# Altium schematic sheet CLOCK_SYNCHRON.SchDoc
size Tabloid; SheetNumber: 8; SheetTotal: 9
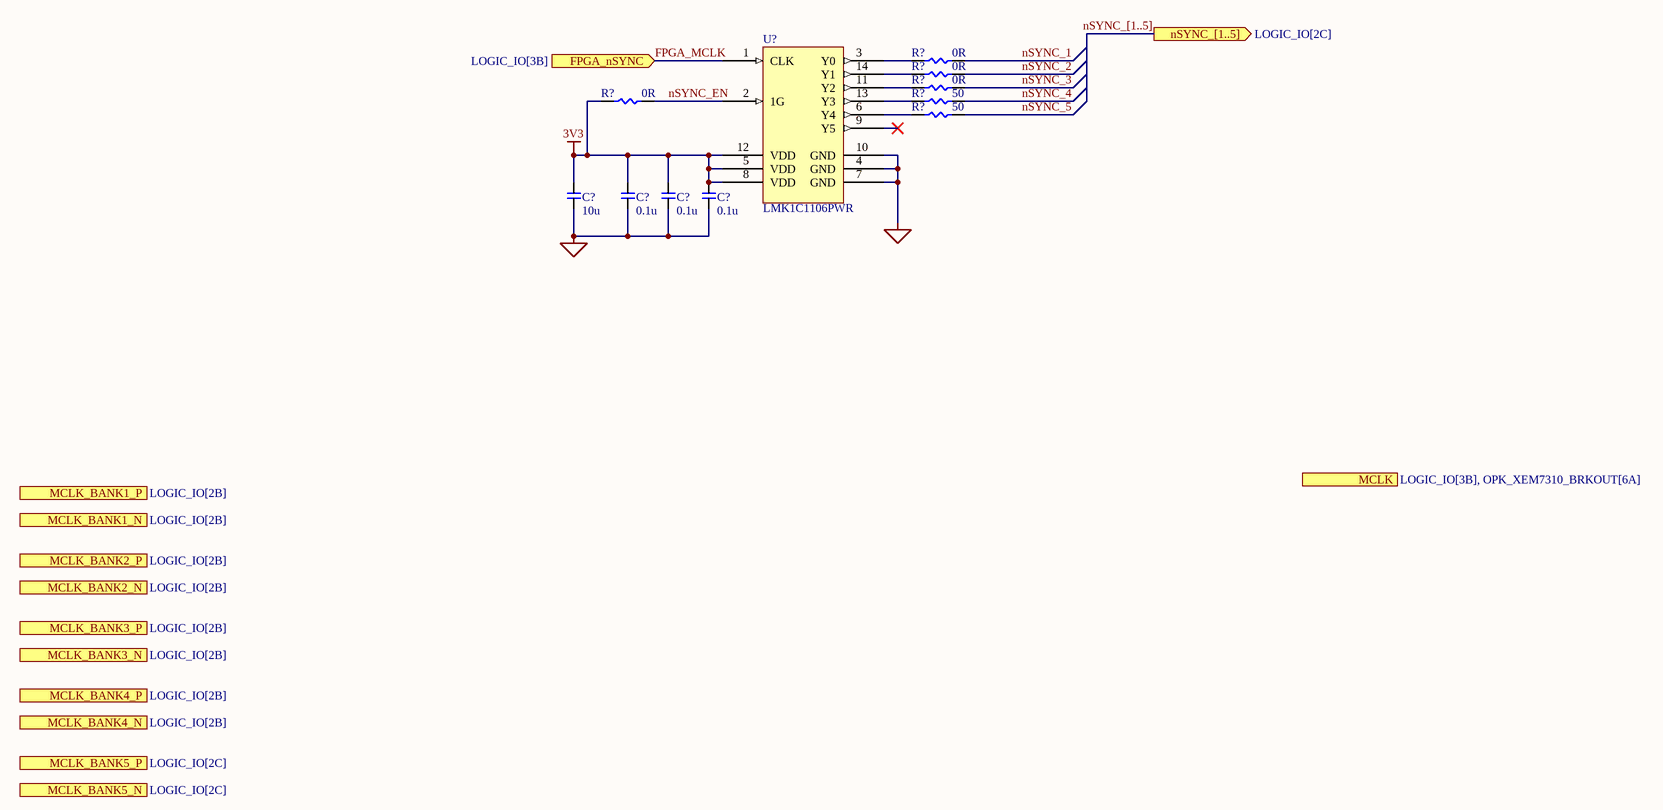
[diagram p0: CLOCK_SYNCHRON.SchDoc]

## Parts
(Parts that share a designator on the sheet are numbered #1, #2 ... from top to bottom, then left to right.)
C?#1  10u
C?#2  0.1u  [CAP_0402]
C?#3  0.1u  [CAP_0402]
C?#4  0.1u  [CAP_0402]
R?#1  0R  [RES_0402]
R?#2  0R  [RES_0402]
R?#3  0R  [RES_0402]
R?#4  0R  [RES_0402]
R?#5  50  [RES_0402]
R?#6  50  [RES_0402]
U?  LMK1C1106PWR  [TSOP65P640X120-14N]

## Ports
FPGA_nSYNC (in, see LOGIC_IO[3B]), MCLK (in, see LOGIC_IO[3B], OPK_XEM7310_BRKOUT[6A]), MCLK_BANK1_N (out, see LOGIC_IO[2B]), MCLK_BANK1_P (out, see LOGIC_IO[2B]), MCLK_BANK2_N (out, see LOGIC_IO[2B]), MCLK_BANK2_P (out, see LOGIC_IO[2B]), MCLK_BANK3_N (out, see LOGIC_IO[2B]), MCLK_BANK3_P (out, see LOGIC_IO[2B]), MCLK_BANK4_N (out, see LOGIC_IO[2B]), MCLK_BANK4_P (out, see LOGIC_IO[2B]), MCLK_BANK5_N (out, see LOGIC_IO[2C]), MCLK_BANK5_P (out, see LOGIC_IO[2C]), nSYNC_[1..5] (out, see LOGIC_IO[2C])

## Nets
3V3: C?#1.2 C?#2.2 C?#3.2 C?#4.2 R?#4.0 U?.5(VDD) U?.8(VDD) U?.12(VDD)
GND: C?#1.1 C?#2.1 C?#3.1 C?#4.1 U?.4(GND) U?.7(GND) U?.10(GND)
FPGA_MCLK: U?.1(CLK) ; port FPGA_nSYNC
nSYNC_1: R?#1.1
nSYNC_2: R?#2.1
nSYNC_3: R?#3.1
nSYNC_4: R?#5.1
nSYNC_5: R?#6.1
nSYNC_EN: R?#4.1 U?.2(1G)
NetR?#1_0: R?#1.0 U?.3(Y0)
NetR?#2_0: R?#2.0 U?.14(Y1)
NetR?#3_0: R?#3.0 U?.11(Y2)
NetR?#5_0: R?#5.0 U?.13(Y3)
NetR?#6_0: R?#6.0 U?.6(Y4)

Not connected (* = marked no-connect by the designer): U? 9(Y5)*

## Buses and harness runs
bus nSYNC_[1..5] = port nSYNC_[1..5]

## Library data of the parts
C?#1 = 10u: CAP CER 10uF 6.3V X5R 0603
C?#2-C?#4 = 0.1u: CAP CER 0.1uF 6V X7R 0402 10%
R?#1-R?#6 = RES_0402: RES SMD 0402; Manufacturer: *; Part Number: *; Power Rating: *
U? = LMK1C1106PWR: IC CLK BUFFER 1:6 250MHZ 14TSSOP; ComponentLink1Description: Datasheet; ComponentLink1URL: https://www.ti.com/lit/ds/symlink/lmk1c1106.pdf?ts=1763572012434